# Altium schematic sheet power_scm.SchDoc
size A; SheetNumber: 1; SheetTotal: 3
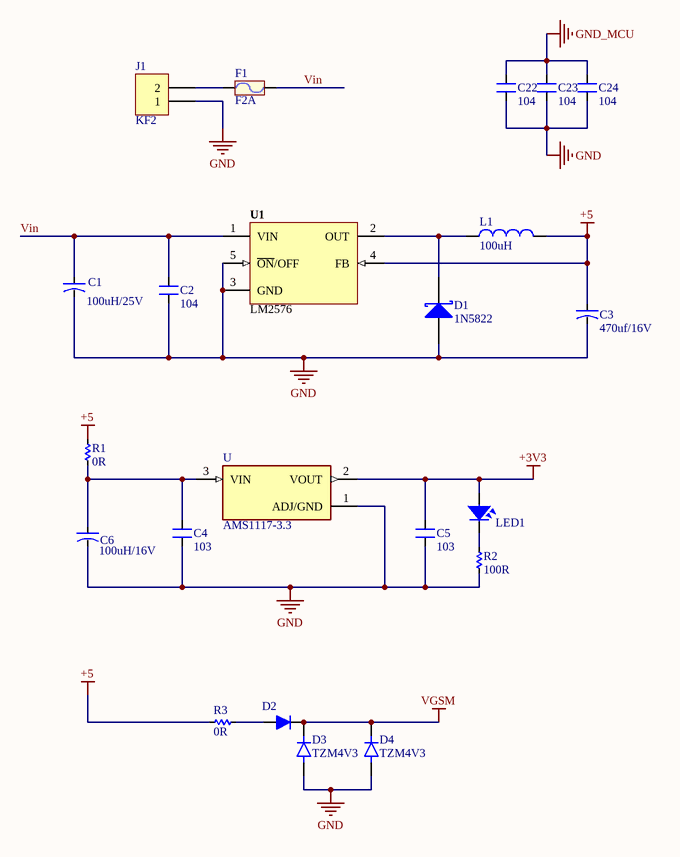
[diagram p0: power_scm.SchDoc]

## Parts
C1  100uH/25V  [CAP-ALU-SMD-6.3x7.7x2.2]
C2  104  [SM-0805]
C3  470uf/16V  [CAP-ALU-SMD-6.3x7.7x2.2]
C4  103  [SM-0805]
C5  103  [SM-0805]
C6  100uH/16V  [CAP-ALU-SMD-6.3x7.7x2.2]
C22  104  [SM-0805]
C23  104  [SM-0805]
C24  104  [SM-0805]
D1  1N5822  [Diode_SS34]
D2  (no value)  [1N4007_SMD]
D3  TZM4V3  [DIO_LL4148]
D4  TZM4V3  [DIO_LL4148]
F1  F2A  [FUSE2]
J1  KF2  [KF2-5.08]
L1  value 100uH  [inductor_smd]  (hidden comment: Inductor)
LED1  LED  [LED-0805-Green]  (value not drawn)
R1  0R  [RES-SMD-0805]
R2  100R  [RES-SMD-0805]
R3  0R  [RES-SMD-0805]
U  AMS1117-3.3  [SOT229P700X180-4N]
U1  LM2576  [TO263]

## Nets
+3V3: C5.1 LED1.1 U.2(VOUT)
+5: C3.1 L1.2 R1.1 R3.1 U1.4(FB)
GND: C1.2 C2.2 C3.2 C4.2 C5.2 C6.2 C22.1 C23.1 C24.1 D1.1(A) D3.A D4.A J1.1 R2.2 U.1(ADJ/GND) U1.3(GND) U1.5(~{ON}/OFF)
GND_MCU: C22.2 C23.2 C24.2
VGSM: D2.2 D3.C D4.C
Vin: C1.1 C2.1 F1.2 U1.1(VIN)
NetC4_1: C4.1 C6.1 R1.2 U.3(VIN)
NetD1_2: D1.2(K) L1.1 U1.2(OUT)
NetD2_1: D2.1 R3.2
NetF1_1: F1.1 J1.2
NetLED1_2: LED1.2 R2.1

## Library data of the parts
C1 C3 C6 = CN-ALU-SMD: Polarized Capacitor (Axial); Published: 8-Jun-2000; LatestRevisionDate: 17-Jul-2002; LatestRevisionNote: Re-released for DXP Platform.; PackageReference: POLAR0.8; Publisher: Altium Limited
C2 C22-C24 = CM: Cap SMD; Value: 103
C4 C5 = CM: Cap SMD; Value: 103
D1 = 1N5819: Schottky diode
D2 = diode
D3 D4 = LL4148: Diode Standard 100V 200mA Surface Mount SOD-80; MF: ON Semiconductor; Package: SOD-80 Taitron; Availability: Unavailable; MP: LL4148; Value: *; SnapEDA_Link: https://www.snapeda.com/parts/LL4148/ON%20Semiconductor/view-part/2182678/?ref=snap; Price: None
F1 = Fuse: Designed by: VanDungEvn; Value: Fuse
J1 = KF2: Manufacturer: Würth Elektronik eiSos GmbH; partNo: 691103110002; ComponentLink1 Description: Manufacturer; ComponentLink2 Description: Datasheet; NoPins: 2; Created Date: 29 October 2013; ComponentLink1URL: http://www.we-online.com; ComponentLink2URL: http://katalog.we-online.de/em/datasheet/6911031100xx.pdf; Created by: Karrer Zheng
LED1 = LED SMD: Value: LED 3 - 5 ly 2 Colour
R1-R3 = Res-SMD: Resistor; Manufacturer: Generic Components; Class: Passive; Published: 08/06/2000; Publisher: Altium Hobart Technology Centre
U = AMS1117-3.3: Sot223/Pkg 1-Amp 3.3-Volt Low Drop Out Voltage Regulatator; MF: Advanced Monolithic Systems; Price: None; Package: None; Value: *; MP: AMS1117-3.3; Availability: Unavailable; SnapEDA_Link: https://www.snapeda.com/parts/AMS1117-3.3/Advanced%20Monolithic%20Systems/view-part/53450/?ref=snap
U1 = LM2576: Max Input Voltage: 12 V; Max Output Current: 3 (6.0 peak) A; Max Output Voltage: mV; Category: IC-Power; Min Input Voltage: mV; Min Output Voltage: mV; Mounting Technology: Surface Mount; Status: Unreleased; Supply Voltage: mV; Temperature Range: -40 to +125 degC
L1 = Inductor: Published: 8-Jun-2000; Revision: July-2002: Re-released for DXP Platform.; Publisher: Altium Limited